# Altium project STM32L476_Core_hw.PrjPcb
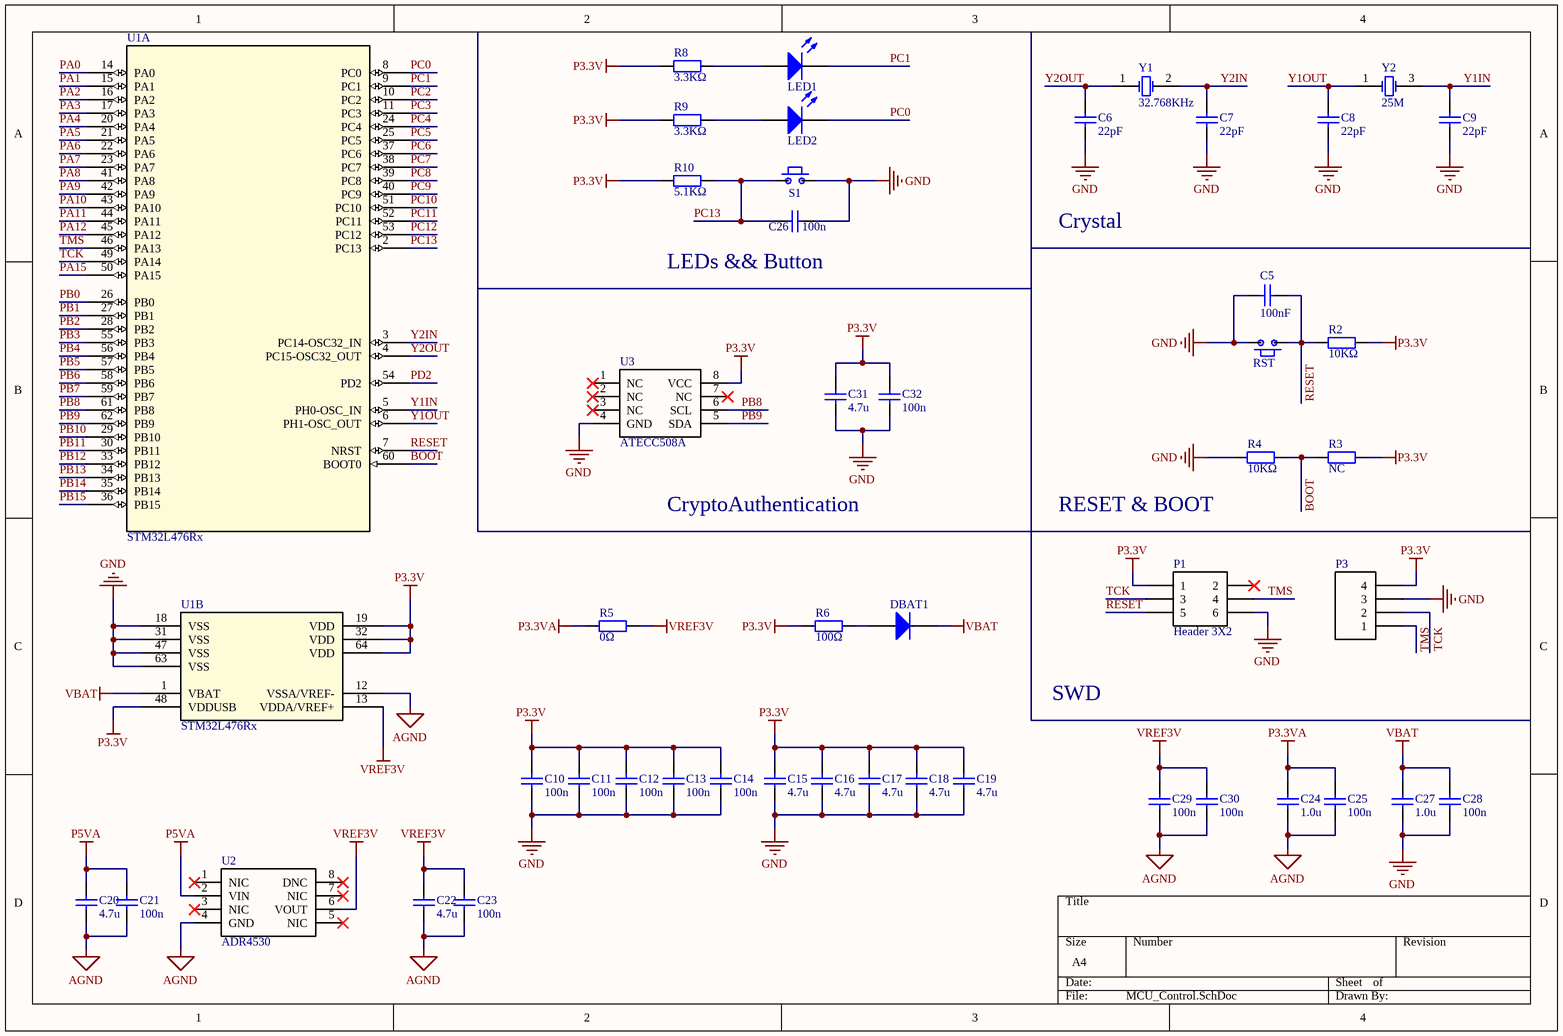
[diagram p0: MCU_Control.SchDoc]
2 sheets, 64 parts. Net scope: global (net labels, ports and power ports of the same name join across sheets).
Board file: STM32L476_Core_hw.PcbDoc
Sheets:
  MCU_Control.SchDoc
  Power.SchDoc

## Sheet MCU_Control.SchDoc
size A4

### Parts
C5  100nF  [0402_C]
C6  22pF  [0402_C]
C7  22pF  [0402_C]
C8  22pF  [0402_C]
C9  22pF  [0402_C]
C10  100n  [0402_C]
C11  100n  [0402_C]
C12  100n  [0402_C]
C13  100n  [0402_C]
C14  100n  [0402_C]
C15  4.7u  [0402_C]
C16  4.7u  [0402_C]
C17  4.7u  [0402_C]
C18  4.7u  [0402_C]
C19  4.7u  [0402_C]
C20  4.7u  [0402_C]
C21  100n  [0402_C]
C22  4.7u  [0402_C]
C23  100n  [0402_C]
C24  1.0u  [0402_C]
C25  100n  [0402_C]
C26  100n  [0402_C]
C27  1.0u  [0402_C]
C28  100n  [0402_C]
C29  100n  [0402_C]
C30  100n  [0402_C]
C31  4.7u  [0402_C]
C32  100n  [0402_C]
DBAT1  B5819W  SL  [SOD-123]  (value not drawn)
LED1  蓝灯 0603  [0603_LED_S1]  (value not drawn)
LED2  蓝灯 0603  [0603_LED_S1]  (value not drawn)
P1  Header 3X2  [DIP6-2.00-BH2]
P3  Header 4  [DIP4-2.00]  (value not drawn)
R2  10KΩ  [0402_R]
R3  NC  [0402_R]
R4  10KΩ  [0402_R]
R5  0Ω  [0402_R]
R6  100Ω  [0402_R]
R8  3.3KΩ  [0402_R]
R9  3.3KΩ  [0402_R]
R10  5.1KΩ  [0402_R]
RST  Button  [SKRKAHE020]  (value not drawn)
S1  Button  [SKRKAHE020]  (value not drawn)
U1  STM32L476Rx  [LQFP64-10x10mm]  (parts A,B of 2)
U2  ADR4530  [SOIC-8-39mm]
U3  ATECC508A  [SOIC-8-39mm]
Y1  32.768KHz  [SMD-3215_2P FC - 135]
Y2  25M  [SMD-3225_4P]

### Nets
 P3.3V: C10.2 C11.2 C12.2 C13.2 C14.2 C15.2 C16.2 C17.2 C18.2 C19.2 C31.2 C32.2 P1.1 P3.4 R2.2 R3.2 R6.1 R8.1 R9.1 R10.1 U1.19(VDD) U1.32(VDD) U1.48(VDDUSB) U1.64(VDD) U3.8(VCC)  [also labelled P3.3V]
AGND: C20.1 C21.1 C22.1 C23.1 C24.1 C25.1 C29.1 C30.1 U1.12(VSSA/VREF-) U2.4(GND)
GND: C5.1 C6.1 C7.1 C8.1 C9.1 C10.1 C11.1 C12.1 C13.1 C14.1 C15.1 C16.1 C17.1 C18.1 C19.1 C26.2 C27.1 C28.1 C31.1 C32.1 P1.6 P3.3 R4.1 RST.2 S1.2 U1.18(VSS) U1.31(VSS) U1.47(VSS) U1.63(VSS) U3.4(GND)
P3.3VA: C24.2 C25.2 R5.1
P5VA: C20.2 C21.2 U2.2(VIN)
VBAT: C27.2 C28.2 DBAT1.2(K) U1.1(VBAT)
VREF3V: C22.2 C23.2 C29.2 C30.2 R5.2 U1.13(VDDA/VREF+) U2.6(VOUT)
BOOT: R3.1 R4.2 U1.60(BOOT0)
PA0: U1.14(PA0)
PA1: U1.15(PA1)
PA2: U1.16(PA2)
PA3: U1.17(PA3)
PA4: U1.20(PA4)
PA5: U1.21(PA5)
PA6: U1.22(PA6)
PA7: U1.23(PA7)
PA8: U1.41(PA8)
PA9: U1.42(PA9)
PA10: U1.43(PA10)
PA11: U1.44(PA11)
PA12: U1.45(PA12)
PA15: U1.50(PA15)
PB0: U1.26(PB0)
PB1: U1.27(PB1)
PB2: U1.28(PB2)
PB3: U1.55(PB3)
PB4: U1.56(PB4)
PB5: U1.57(PB5)
PB6: U1.58(PB6)
PB7: U1.59(PB7)
PB8: U1.61(PB8) U3.6(SCL)
PB9: U1.62(PB9) U3.5(SDA)
PB10: U1.29(PB10)
PB11: U1.30(PB11)
PB12: U1.33(PB12)
PB13: U1.34(PB13)
PB14: U1.35(PB14)
PB15: U1.36(PB15)
PC0: LED2.K U1.8(PC0)
PC1: LED1.K U1.9(PC1)
PC2: U1.10(PC2)
PC3: U1.11(PC3)
PC4: U1.24(PC4)
PC5: U1.25(PC5)
PC6: U1.37(PC6)
PC7: U1.38(PC7)
PC8: U1.39(PC8)
PC9: U1.40(PC9)
PC10: U1.51(PC10)
PC11: U1.52(PC11)
PC12: U1.53(PC12)
PC13: C26.1 R10.2 S1.1 U1.2(PC13)
PD2: U1.54(PD2)
RESET: C5.2 P1.5 R2.1 RST.1 U1.7(NRST)
TCK: P1.3 P3.2 U1.49(PA14)
TMS: P1.4 P3.1 U1.46(PA13)
Y1IN: C9.2 U1.5(PH0-OSC_IN) Y2.3(OSC2)
Y1OUT: C8.2 U1.6(PH1-OSC_OUT) Y2.1(OSC1)
Y2IN: C7.2 U1.3(PC14-OSC32_IN) Y1.2(OSC2)
Y2OUT: C6.2 U1.4(PC15-OSC32_OUT) Y1.1(OSC1)
NetDBAT1_1: DBAT1.1(A) R6.2
NetLED1_A: LED1.A R8.2
NetLED2_A: LED2.A R9.2

Not connected (* = marked no-connect by the designer): P1 2*; U2 1(NIC)* 3(NIC)* 5(NIC)* 7(NIC)* 8(DNC)*; U3 1(NC)* 2(NC)* 3(NC)* 7(NC)*

### Notes on the sheet
- Crystal
- (near C26) LEDs && Button
- CryptoAuthentication
- RESET & BOOT
- SWD

### Library data of the parts
C5 C10-C14 C21 C23 C25 C26 C28-C30 C32 = 0402 100nF (104) 10% 16V: 贴片电容; ComponentLink1Description: 供应商链接; ComponentLink1URL: http://www.szlcsc.com/product/details_1877.html; Package: 0402; Supplier: LC; SuppliersPartNumber: C1525
C6-C9 = 0402 22pF (220) 5% 50V: 贴片电容; ComponentLink1Description: 供应商链接; ComponentLink1URL: http://www.szlcsc.com/product/details_1907.html; Package: 0402; Supplier: LC; SuppliersPartNumber: C1555
C15-C20 C22 C31 = 0402 4.7uF (475) 20% 10V: 贴片电容; ComponentLink1Description: 供应商链接; ComponentLink1URL: http://www.szlcsc.com/product/details_24469.html; Package: 0402; Supplier: LC; SuppliersPartNumber: C23733
C24 C27 = 0402 1.0uF (105) 10% 25V: 贴片电容; ComponentLink1Description: 供应商链接; ComponentLink1URL: http://www.szlcsc.com/product/details_53938.html; Package: 0402; Supplier: LC; SuppliersPartNumber: C52923
DBAT1 = SOD-123 B5819W  SL: 肖特基二极管; ComponentLink1Description: 供应商链接; ComponentLink1URL: http://www.szlcsc.com/product/details_9093.html; Package: SOD-123; Supplier: LC; SuppliersPartNumber: C8598
LED1 LED2 = 0603 蓝灯: 发光二极管; ComponentLink1Description: 供应商链接; ComponentLink1URL: http://www.szlcsc.com/product/details_73150.html; Package: 0603; Supplier: LC; SuppliersPartNumber: C72041
P1 = Header 3X2: Header, 3-Pin, Dual row
P3 = Header 4: Header, 4-Pin; LatestRevisionDate: 17-Jul-2002; LatestRevisionNote: Re-released for DXP Platform.; Publisher: Altium Limited
R2-R4 = 0402 10KΩ (1002) 1%: 贴片电阻; ComponentLink1Description: 供应商链接; ComponentLink1URL: http://www.szlcsc.com/product/details_26487.html; Package: 0402; Supplier: LC; SuppliersPartNumber: C25744
R5 = 0402 0Ω (0R0) 1%: 贴片电阻; ComponentLink1Description: 供应商链接; ComponentLink1URL: http://www.szlcsc.com/product/details_17853.html; Package: 0402; Supplier: LC; SuppliersPartNumber: C17168
R6 = 0402 100Ω (1000) 1%: 贴片电阻; ComponentLink1Description: 供应商链接; ComponentLink1URL: http://www.szlcsc.com/product/details_25819.html; Package: 0402; Supplier: LC; SuppliersPartNumber: C25076
R8 R9 = 0402 3.3KΩ (3301) 1%: 贴片电阻; ComponentLink1Description: 供应商链接; ComponentLink1URL: http://www.szlcsc.com/product/details_26633.html; Package: 0402; Supplier: LC; SuppliersPartNumber: C25890
R10 = 0402 5.1KΩ (5101) 1%: 贴片电阻; ComponentLink1Description: 供应商链接; ComponentLink1URL: http://www.szlcsc.com/product/details_26648.html; Package: 0402; Supplier: LC; SuppliersPartNumber: C25905
U1 = STM32L476Rx: Manufacturer_Part_Number: stm32l486rx; Vendor: ST Microelectronics; Copyright: Copyright (C) 2016 Accelerated Designs. All rights reserved; RefDes: RefDes; Type: Type; Value: Value
U2 = ADR4530: Ultra-Low-Noise, High-Accuracy 3.0V Voltage Reference
U3 = ATECC508A: Security ICs / Authentication ICs
Y1 = SMD-3215_2P 32.768KHz 20ppm 12.5pF: 贴片晶振; ComponentLink1Description: 供应商链接; ComponentLink1URL: http://www.szlcsc.com/product/details_33310.html; Package: SMD-3215_2P; Supplier: LC; SuppliersPartNumber: C32346
Y2 = SMD-3225_4P  25MHZ 12PF 10PPM: 贴片晶振; ComponentLink1Description: 供应商链接; ComponentLink1URL: http://www.szlcsc.com/product/details_9526.html; Package: SMD-3225_4P; Supplier: LC; SuppliersPartNumber: C9006

## Sheet Power.SchDoc
size A4
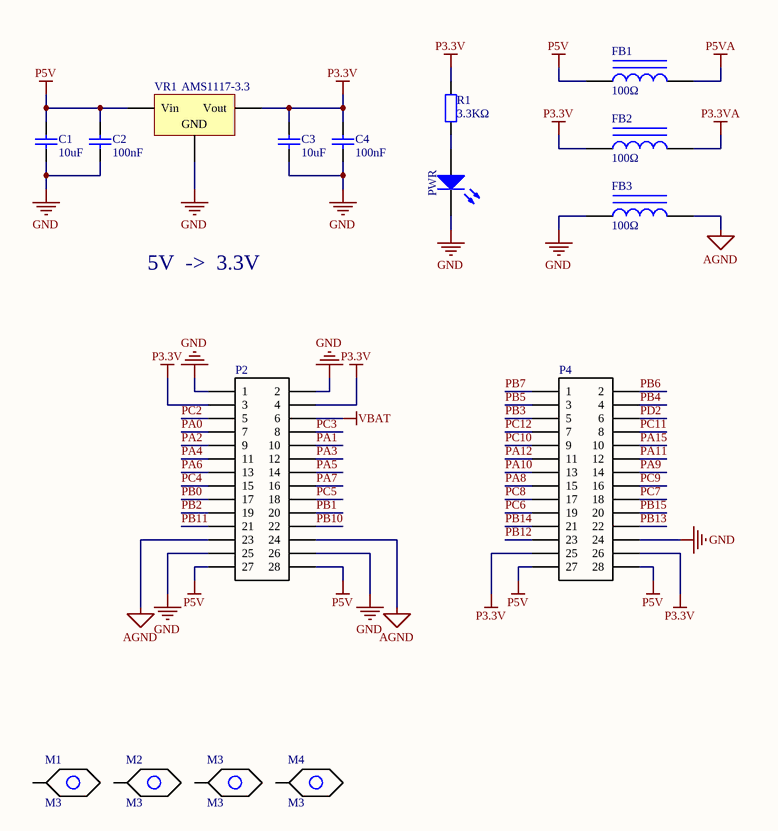
[diagram p1: Power.SchDoc]

### Parts
C1  10uF  [0603_C]
C2  100nF  [0402_C]
C3  10uF  [0603_C]
C4  100nF  [0402_C]
FB1  100Ω  [0805_L]
FB2  100Ω  [0805_L]
FB3  100Ω  [0805_L]
M1  M3  [M3]
M2  M3  [M3]
M3  M3  [M3]
M4  M3  [M3]
P2  Header 14X2  [DIP28-2.54]  (value not drawn)
P4  Header 14X2  [DIP28-2.54]  (value not drawn)
PWR  蓝灯 0603  [0603_LED_S1]  (value not drawn)
R1  3.3KΩ  [0402_R]
VR1  AMS1117-3.3  [SOT-223]

### Nets
AGND: FB3.2 P2.23 P2.24
GND: C1.1 C2.1 C3.1 C4.1 FB3.1 P2.1 P2.2 P2.25 P2.26 P4.24 PWR.K VR1.1(GND)
P3.3V: C3.2 C4.2 FB2.1 P2.3 P2.4 P4.25 P4.26 R1.2 VR1.2(Vout)  [project net  P3.3V]
P3.3VA: FB2.2
P5V: C1.2 C2.2 FB1.1 P2.27 P2.28 P4.27 P4.28 VR1.3(Vin)
P5VA: FB1.2
VBAT: P2.6
PA0: P2.7
PA1: P2.10
PA2: P2.9
PA3: P2.12
PA4: P2.11
PA5: P2.14
PA6: P2.13
PA7: P2.16
PA8: P4.15
PA9: P4.14
PA10: P4.13
PA11: P4.12
PA12: P4.11
PA15: P4.10
PB0: P2.17
PB1: P2.20
PB2: P2.19
PB3: P4.5
PB4: P4.4
PB5: P4.3
PB6: P4.2
PB7: P4.1
PB10: P2.22
PB11: P2.21
PB12: P4.23
PB13: P4.22
PB14: P4.21
PB15: P4.20
PC2: P2.5
PC3: P2.8
PC4: P2.15
PC5: P2.18
PC6: P4.19
PC7: P4.18
PC8: P4.17
PC9: P4.16
PC10: P4.9
PC11: P4.8
PC12: P4.7
PD2: P4.6
NetPWR_A: PWR.A R1.1

Not connected (* = marked no-connect by the designer): M1 0; M2 0; M3 0; M4 0

### Notes on the sheet
- 5V  ->  3.3V

### Library data of the parts
C1 C3 = 0603 10uF (106) 10% 10V: 贴片电容; ComponentLink1Description: 供应商链接; ComponentLink1URL: http://www.szlcsc.com/product/details_20411.html; Package: 0603; Supplier: LC; SuppliersPartNumber: C19702
C2 C4 = 0402 100nF (104) 10% 16V: 贴片电容; ComponentLink1Description: 供应商链接; ComponentLink1URL: http://www.szlcsc.com/product/details_1877.html; Package: 0402; Supplier: LC; SuppliersPartNumber: C1525
FB1-FB3 = 0805 100Ω 25% 100MHz: 贴片磁珠; ComponentLink1Description: 供应商链接; ComponentLink1URL: http://www.szlcsc.com/product/details_1367.html; Package: 0805; Supplier: LC; SuppliersPartNumber: C1015
P2 P4 = Header 14X2: Header, 14-Pin, Dual row; LatestRevisionDate: 17-Jul-2002; LatestRevisionNote: Re-released for DXP Platform.; Publisher: Altium Limited
PWR = 0603 蓝灯: 发光二极管; ComponentLink1Description: 供应商链接; ComponentLink1URL: http://www.szlcsc.com/product/details_73150.html; Package: 0603; Supplier: LC; SuppliersPartNumber: C72041
R1 = 0402 3.3KΩ (3301) 1%: 贴片电阻; ComponentLink1Description: 供应商链接; ComponentLink1URL: http://www.szlcsc.com/product/details_26633.html; Package: 0402; Supplier: LC; SuppliersPartNumber: C25890
VR1 = SOT-223 AMS1117-3.3: 低压差线性稳压(LDO); ComponentLink1Description: 供应商链接; ComponentLink1URL: http://www.szlcsc.com/product/details_6652.html; Package: SOT-223; Supplier: LC; SuppliersPartNumber: C6186

## Nets that join several sheets
 P3.3V: MCU_Control (25 pins), Power (9 pins)
AGND: MCU_Control (10 pins), Power (FB3.2 P2.23 P2.24)
GND: MCU_Control (30 pins), Power (12 pins)
P3.3VA: MCU_Control (C24.2 C25.2 R5.1), Power (FB2.2)
P5VA: MCU_Control (C20.2 C21.2 U2.2), Power (FB1.2)
VBAT: MCU_Control (C27.2 C28.2 DBAT1.2 U1.1), Power (P2.6)
PA0: MCU_Control (U1.14), Power (P2.7)
PA1: MCU_Control (U1.15), Power (P2.10)
PA2: MCU_Control (U1.16), Power (P2.9)
PA3: MCU_Control (U1.17), Power (P2.12)
PA4: MCU_Control (U1.20), Power (P2.11)
PA5: MCU_Control (U1.21), Power (P2.14)
PA6: MCU_Control (U1.22), Power (P2.13)
PA7: MCU_Control (U1.23), Power (P2.16)
PA8: MCU_Control (U1.41), Power (P4.15)
PA9: MCU_Control (U1.42), Power (P4.14)
PA10: MCU_Control (U1.43), Power (P4.13)
PA11: MCU_Control (U1.44), Power (P4.12)
PA12: MCU_Control (U1.45), Power (P4.11)
PA15: MCU_Control (U1.50), Power (P4.10)
PB0: MCU_Control (U1.26), Power (P2.17)
PB1: MCU_Control (U1.27), Power (P2.20)
PB2: MCU_Control (U1.28), Power (P2.19)
PB3: MCU_Control (U1.55), Power (P4.5)
PB4: MCU_Control (U1.56), Power (P4.4)
PB5: MCU_Control (U1.57), Power (P4.3)
PB6: MCU_Control (U1.58), Power (P4.2)
PB7: MCU_Control (U1.59), Power (P4.1)
PB10: MCU_Control (U1.29), Power (P2.22)
PB11: MCU_Control (U1.30), Power (P2.21)
PB12: MCU_Control (U1.33), Power (P4.23)
PB13: MCU_Control (U1.34), Power (P4.22)
PB14: MCU_Control (U1.35), Power (P4.21)
PB15: MCU_Control (U1.36), Power (P4.20)
PC2: MCU_Control (U1.10), Power (P2.5)
PC3: MCU_Control (U1.11), Power (P2.8)
PC4: MCU_Control (U1.24), Power (P2.15)
PC5: MCU_Control (U1.25), Power (P2.18)
PC6: MCU_Control (U1.37), Power (P4.19)
PC7: MCU_Control (U1.38), Power (P4.18)
PC8: MCU_Control (U1.39), Power (P4.17)
PC9: MCU_Control (U1.40), Power (P4.16)
PC10: MCU_Control (U1.51), Power (P4.9)
PC11: MCU_Control (U1.52), Power (P4.8)
PC12: MCU_Control (U1.53), Power (P4.7)
PD2: MCU_Control (U1.54), Power (P4.6)